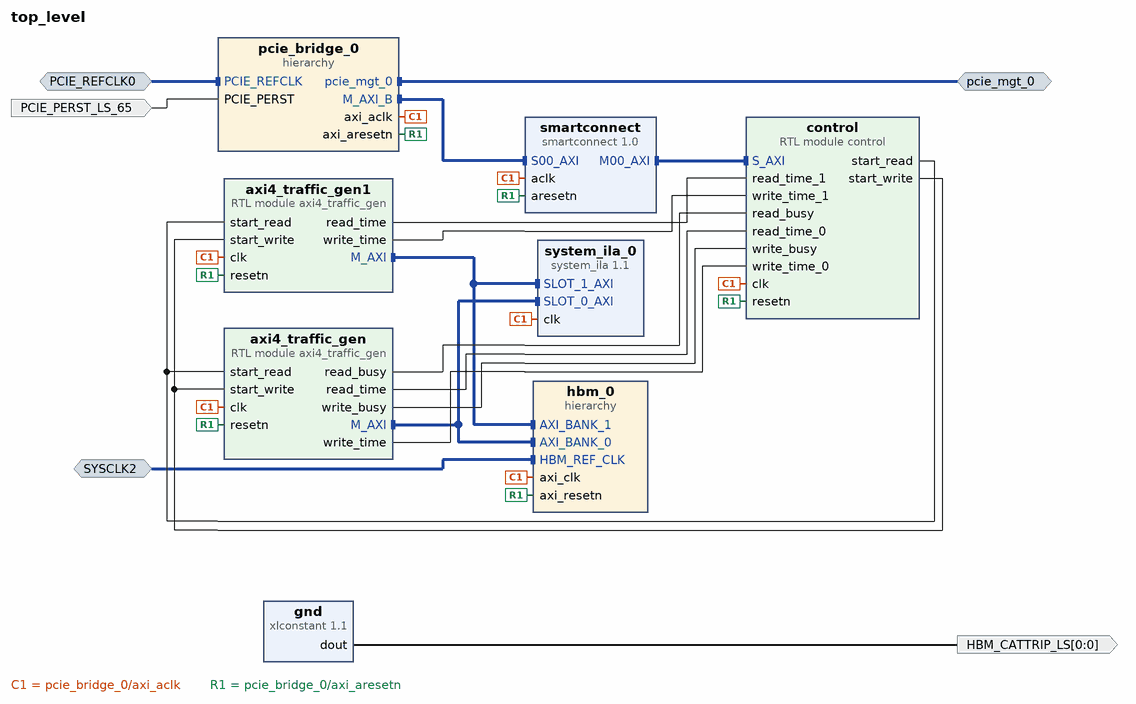
[diagram p0: block diagram of the top level]
# Vivado block design top_level, xcu55c-fsvh2892-2L-e, Vivado 2021.1
create_bd_design top_level

create_bd_intf_port -mode Slave -vlnv xilinx.com:interface:diff_clock_rtl:1.0 SYSCLK2
create_bd_intf_port -mode Slave -vlnv xilinx.com:interface:diff_clock_rtl:1.0 PCIE_REFCLK0
create_bd_intf_port -mode Master -vlnv xilinx.com:interface:pcie_7x_mgt_rtl:1.0 pcie_mgt_0
create_bd_port -dir O -from 0 -to 0 HBM_CATTRIP_LS
create_bd_port -dir I -type rst PCIE_PERST_LS_65

create_bd_cell -type hier pcie_bridge_0
create_bd_cell -type ip -vlnv xilinx.com:ip:smartconnect:1.0 smartconnect
set_property -dict {CONFIG.NUM_SI 1} [get_bd_cells smartconnect]
create_bd_cell -type ip -vlnv xilinx.com:ip:xlconstant:1.1 gnd
set_property -dict {CONFIG.CONST_VAL 0} [get_bd_cells gnd]
create_bd_cell -type hier hbm_0
create_bd_cell -type module -reference axi4_traffic_gen axi4_traffic_gen
create_bd_cell -type module -reference axi4_traffic_gen axi4_traffic_gen1
create_bd_cell -type module -reference control control
create_bd_cell -type ip -vlnv xilinx.com:ip:system_ila:1.1 system_ila_0
set_property -dict {CONFIG.C_DATA_DEPTH 2048 CONFIG.C_NUM_MONITOR_SLOTS 2} [get_bd_cells system_ila_0]

# ---- hierarchy /pcie_bridge_0 ----
current_bd_instance /pcie_bridge_0
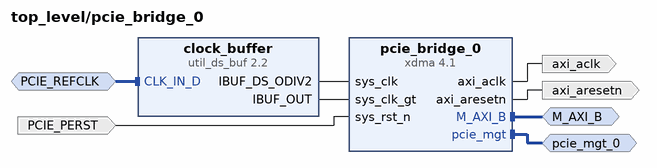
[diagram p1: block diagram inside /pcie_bridge_0]
create_bd_intf_pin -mode Master -vlnv xilinx.com:interface:pcie_7x_mgt_rtl:1.0 pcie_mgt_0
create_bd_intf_pin -mode Slave -vlnv xilinx.com:interface:diff_clock_rtl:1.0 PCIE_REFCLK
create_bd_intf_pin -mode Master -vlnv xilinx.com:interface:aximm_rtl:1.0 M_AXI_B
create_bd_pin -dir I -type rst PCIE_PERST
create_bd_pin -dir O axi_aclk
create_bd_pin -dir O axi_aresetn

create_bd_cell -type ip -vlnv xilinx.com:ip:xdma:4.1 pcie_bridge_0
set_property -dict [list \
  CONFIG.PF0_DEVICE_ID_mqdma 9048 \
  CONFIG.PF0_SRIOV_VF_DEVICE_ID A048 \
  CONFIG.PF2_DEVICE_ID_mqdma 9248 \
  CONFIG.PF3_DEVICE_ID_mqdma 9348 \
  CONFIG.axi_addr_width 64 \
  CONFIG.axi_data_width 512_bit \
  CONFIG.axisten_freq 250 \
  CONFIG.bridge_burst true \
  CONFIG.en_axi_slave_if false \
  CONFIG.en_gt_selection false \
  CONFIG.functional_mode AXI_Bridge \
  CONFIG.mode_selection Advanced \
  CONFIG.pcie_blk_locn PCIE4C_X1Y0 \
  CONFIG.pf0_bar0_scale Megabytes \
  CONFIG.pf0_bar0_size 1 \
  CONFIG.pf0_device_id 903F \
  CONFIG.pf0_msi_enabled false \
  CONFIG.pl_link_cap_max_link_speed 16.0_GT/s \
  CONFIG.pl_link_cap_max_link_width X8 \
] [get_bd_cells pcie_bridge_0]
create_bd_cell -type ip -vlnv xilinx.com:ip:util_ds_buf:2.2 clock_buffer
set_property -dict {CONFIG.C_BUF_TYPE IBUFDSGTE} [get_bd_cells clock_buffer]

# ---- hierarchy /hbm_0 ----
current_bd_instance /hbm_0
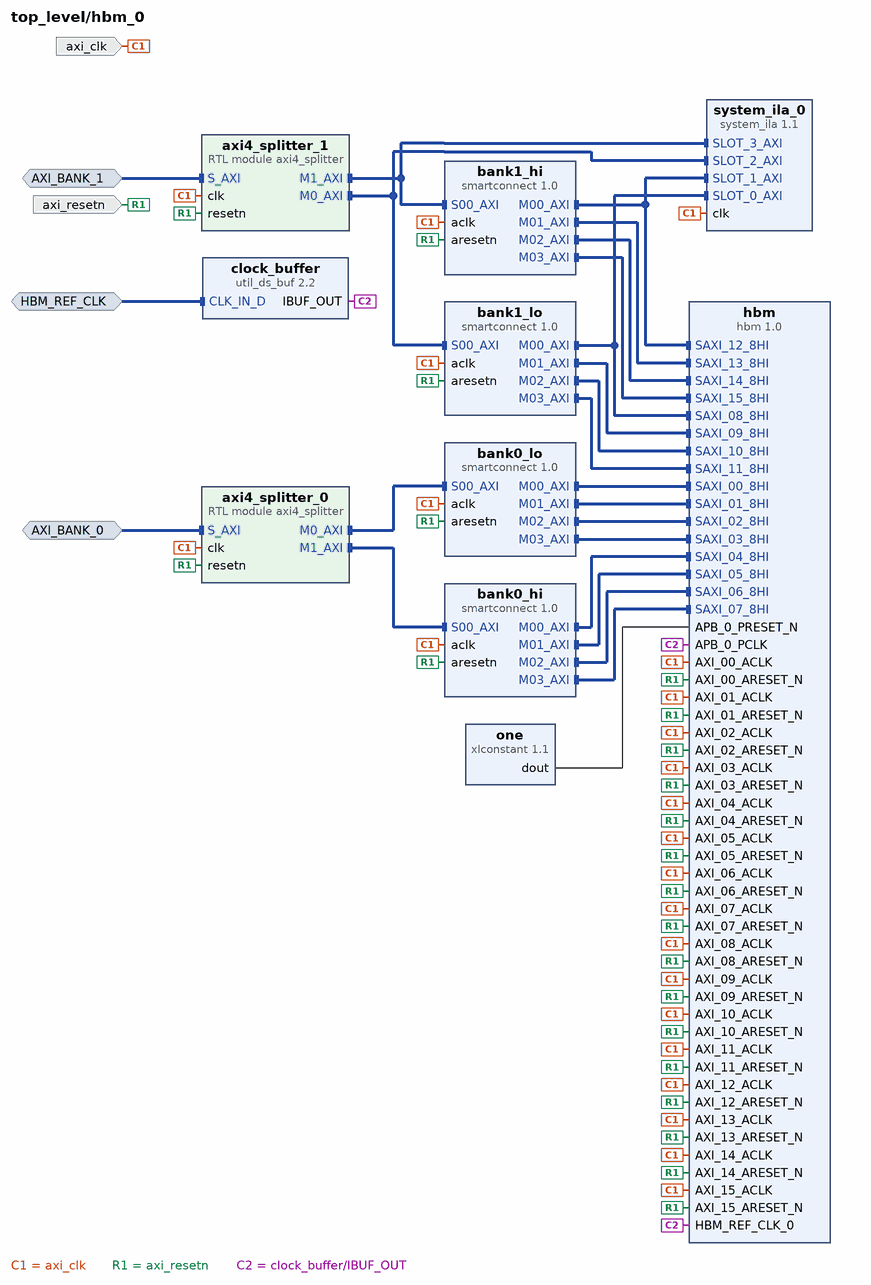
[diagram p2: block diagram inside /hbm_0]
create_bd_intf_pin -mode Slave -vlnv xilinx.com:interface:diff_clock_rtl:1.0 HBM_REF_CLK
create_bd_intf_pin -mode Slave -vlnv xilinx.com:interface:aximm_rtl:1.0 AXI_BANK_0
create_bd_intf_pin -mode Slave -vlnv xilinx.com:interface:aximm_rtl:1.0 AXI_BANK_1
create_bd_pin -dir I axi_clk
create_bd_pin -dir I axi_resetn

create_bd_cell -type ip -vlnv xilinx.com:ip:hbm:1.0 hbm
set_property -dict [list \
  CONFIG.USER_APB_EN false \
  CONFIG.USER_AXI_CLK_FREQ 250 \
  CONFIG.USER_CLK_SEL_LIST1 AXI_23_ACLK \
  CONFIG.USER_HBM_CP_1 3 \
  CONFIG.USER_HBM_DENSITY 8GB \
  CONFIG.USER_HBM_FBDIV_1 5 \
  CONFIG.USER_HBM_HEX_CP_RES_1 0x0000B300 \
  CONFIG.USER_HBM_HEX_FBDIV_CLKOUTDIV_1 0x00000142 \
  CONFIG.USER_HBM_HEX_LOCK_FB_REF_DLY_1 0x00000a0a \
  CONFIG.USER_HBM_LOCK_FB_DLY_1 10 \
  CONFIG.USER_HBM_LOCK_REF_DLY_1 10 \
  CONFIG.USER_HBM_RES_1 11 \
  CONFIG.USER_HBM_STACK 1 \
  CONFIG.USER_MC0_ENABLE_ECC_CORRECTION true \
  CONFIG.USER_MC0_ENABLE_ECC_SCRUBBING false \
  CONFIG.USER_MC0_INITILIZE_MEM_USING_ECC_SCRUB false \
  CONFIG.USER_MC0_TRAFFIC_OPTION Linear \
  CONFIG.USER_MC10_ENABLE_ECC_CORRECTION true \
  CONFIG.USER_MC10_ENABLE_ECC_SCRUBBING false \
  CONFIG.USER_MC10_INITILIZE_MEM_USING_ECC_SCRUB false \
  CONFIG.USER_MC10_TRAFFIC_OPTION Linear \
  CONFIG.USER_MC11_ENABLE_ECC_CORRECTION true \
  CONFIG.USER_MC11_ENABLE_ECC_SCRUBBING false \
  CONFIG.USER_MC11_INITILIZE_MEM_USING_ECC_SCRUB false \
  CONFIG.USER_MC11_TRAFFIC_OPTION Linear \
  CONFIG.USER_MC12_ENABLE_ECC_CORRECTION true \
  CONFIG.USER_MC12_ENABLE_ECC_SCRUBBING false \
  CONFIG.USER_MC12_INITILIZE_MEM_USING_ECC_SCRUB false \
  CONFIG.USER_MC12_TRAFFIC_OPTION Linear \
  CONFIG.USER_MC13_ENABLE_ECC_CORRECTION true \
  CONFIG.USER_MC13_ENABLE_ECC_SCRUBBING false \
  CONFIG.USER_MC13_INITILIZE_MEM_USING_ECC_SCRUB false \
  CONFIG.USER_MC13_TRAFFIC_OPTION Linear \
  CONFIG.USER_MC14_ENABLE_ECC_CORRECTION true \
  CONFIG.USER_MC14_ENABLE_ECC_SCRUBBING false \
  CONFIG.USER_MC14_INITILIZE_MEM_USING_ECC_SCRUB false \
  CONFIG.USER_MC14_TRAFFIC_OPTION Linear \
  CONFIG.USER_MC15_ENABLE_ECC_CORRECTION true \
  CONFIG.USER_MC15_ENABLE_ECC_SCRUBBING false \
  CONFIG.USER_MC15_INITILIZE_MEM_USING_ECC_SCRUB false \
  CONFIG.USER_MC15_TRAFFIC_OPTION Linear \
  CONFIG.USER_MC1_ENABLE_ECC_CORRECTION true \
  CONFIG.USER_MC1_ENABLE_ECC_SCRUBBING false \
  CONFIG.USER_MC1_INITILIZE_MEM_USING_ECC_SCRUB false \
  CONFIG.USER_MC1_TRAFFIC_OPTION Linear \
  CONFIG.USER_MC2_ENABLE_ECC_CORRECTION true \
  CONFIG.USER_MC2_ENABLE_ECC_SCRUBBING false \
  CONFIG.USER_MC2_INITILIZE_MEM_USING_ECC_SCRUB false \
  CONFIG.USER_MC2_TRAFFIC_OPTION Linear \
  CONFIG.USER_MC3_ENABLE_ECC_CORRECTION true \
  CONFIG.USER_MC3_ENABLE_ECC_SCRUBBING false \
  CONFIG.USER_MC3_INITILIZE_MEM_USING_ECC_SCRUB false \
  CONFIG.USER_MC3_TRAFFIC_OPTION Linear \
  CONFIG.USER_MC4_ENABLE_ECC_CORRECTION true \
  CONFIG.USER_MC4_ENABLE_ECC_SCRUBBING false \
  CONFIG.USER_MC4_INITILIZE_MEM_USING_ECC_SCRUB false \
  CONFIG.USER_MC4_TRAFFIC_OPTION Linear \
  CONFIG.USER_MC5_ENABLE_ECC_CORRECTION true \
  CONFIG.USER_MC5_ENABLE_ECC_SCRUBBING false \
  CONFIG.USER_MC5_INITILIZE_MEM_USING_ECC_SCRUB false \
  CONFIG.USER_MC5_TRAFFIC_OPTION Linear \
  CONFIG.USER_MC6_ENABLE_ECC_CORRECTION true \
  CONFIG.USER_MC6_ENABLE_ECC_SCRUBBING false \
  CONFIG.USER_MC6_INITILIZE_MEM_USING_ECC_SCRUB false \
  CONFIG.USER_MC6_TRAFFIC_OPTION Linear \
  CONFIG.USER_MC7_ENABLE_ECC_CORRECTION true \
  CONFIG.USER_MC7_ENABLE_ECC_SCRUBBING false \
  CONFIG.USER_MC7_INITILIZE_MEM_USING_ECC_SCRUB false \
  CONFIG.USER_MC7_TRAFFIC_OPTION Linear \
  CONFIG.USER_MC8_ENABLE_ECC_CORRECTION true \
  CONFIG.USER_MC8_ENABLE_ECC_SCRUBBING false \
  CONFIG.USER_MC8_INITILIZE_MEM_USING_ECC_SCRUB false \
  CONFIG.USER_MC8_TRAFFIC_OPTION Linear \
  CONFIG.USER_MC9_ENABLE_ECC_CORRECTION true \
  CONFIG.USER_MC9_ENABLE_ECC_SCRUBBING false \
  CONFIG.USER_MC9_INITILIZE_MEM_USING_ECC_SCRUB false \
  CONFIG.USER_MC9_TRAFFIC_OPTION Linear \
  CONFIG.USER_MC_ENABLE_08 FALSE \
  CONFIG.USER_MC_ENABLE_09 FALSE \
  CONFIG.USER_MC_ENABLE_10 FALSE \
  CONFIG.USER_MC_ENABLE_11 FALSE \
  CONFIG.USER_MC_ENABLE_12 FALSE \
  CONFIG.USER_MC_ENABLE_13 FALSE \
  CONFIG.USER_MC_ENABLE_14 FALSE \
  CONFIG.USER_MC_ENABLE_15 FALSE \
  CONFIG.USER_MC_ENABLE_APB_01 FALSE \
  CONFIG.USER_PHY_ENABLE_08 FALSE \
  CONFIG.USER_PHY_ENABLE_09 FALSE \
  CONFIG.USER_PHY_ENABLE_10 FALSE \
  CONFIG.USER_PHY_ENABLE_11 FALSE \
  CONFIG.USER_PHY_ENABLE_12 FALSE \
  CONFIG.USER_PHY_ENABLE_13 FALSE \
  CONFIG.USER_PHY_ENABLE_14 FALSE \
  CONFIG.USER_PHY_ENABLE_15 FALSE \
  CONFIG.USER_SWITCH_ENABLE_00 FALSE \
] [get_bd_cells hbm]
create_bd_cell -type ip -vlnv xilinx.com:ip:util_ds_buf:2.2 clock_buffer
create_bd_cell -type ip -vlnv xilinx.com:ip:smartconnect:1.0 bank0_lo
set_property -dict {CONFIG.HAS_ARESETN 1 CONFIG.NUM_MI 4 CONFIG.NUM_SI 1} [get_bd_cells bank0_lo]
create_bd_cell -type ip -vlnv xilinx.com:ip:xlconstant:1.1 one
create_bd_cell -type ip -vlnv xilinx.com:ip:smartconnect:1.0 bank0_hi
set_property -dict {CONFIG.HAS_ARESETN 1 CONFIG.NUM_MI 4 CONFIG.NUM_SI 1} [get_bd_cells bank0_hi]
create_bd_cell -type ip -vlnv xilinx.com:ip:smartconnect:1.0 bank1_lo
set_property -dict {CONFIG.HAS_ARESETN 1 CONFIG.NUM_MI 4 CONFIG.NUM_SI 1} [get_bd_cells bank1_lo]
create_bd_cell -type ip -vlnv xilinx.com:ip:smartconnect:1.0 bank1_hi
set_property -dict {CONFIG.HAS_ARESETN 1 CONFIG.NUM_MI 4 CONFIG.NUM_SI 1} [get_bd_cells bank1_hi]
create_bd_cell -type ip -vlnv xilinx.com:ip:system_ila:1.1 system_ila_0
set_property -dict {CONFIG.C_NUM_MONITOR_SLOTS 4} [get_bd_cells system_ila_0]
create_bd_cell -type module -reference axi4_splitter axi4_splitter_0
set_property -dict {CONFIG.BASE_ADDR1 0x0000000080000000} [get_bd_cells axi4_splitter_0]
create_bd_cell -type module -reference axi4_splitter axi4_splitter_1
set_property -dict {CONFIG.BASE_ADDR0 0x0000000100000000 CONFIG.BASE_ADDR1 0x0000000180000000} [get_bd_cells axi4_splitter_1]

# ---- connections ----

current_bd_instance /pcie_bridge_0
connect_bd_intf_net -intf_net CLK_IN_D_0_1 [get_bd_intf_pins PCIE_REFCLK] [get_bd_intf_pins clock_buffer/CLK_IN_D]
connect_bd_intf_net -intf_net xdma_0_M_AXI_B [get_bd_intf_pins M_AXI_B] [get_bd_intf_pins pcie_bridge_0/M_AXI_B]
connect_bd_intf_net -intf_net xdma_0_pcie_mgt [get_bd_intf_pins pcie_mgt_0] [get_bd_intf_pins pcie_bridge_0/pcie_mgt]
connect_bd_net -net sys_rst_n_0_1 [get_bd_pins PCIE_PERST] [get_bd_pins pcie_bridge_0/sys_rst_n]
connect_bd_net -net util_ds_buf_0_IBUF_DS_ODIV2 [get_bd_pins clock_buffer/IBUF_DS_ODIV2] [get_bd_pins pcie_bridge_0/sys_clk]
connect_bd_net -net util_ds_buf_0_IBUF_OUT [get_bd_pins clock_buffer/IBUF_OUT] [get_bd_pins pcie_bridge_0/sys_clk_gt]
connect_bd_net -net xdma_0_axi_aclk [get_bd_pins pcie_bridge_0/axi_aclk] [get_bd_pins axi_aclk]
connect_bd_net -net xdma_0_axi_aresetn [get_bd_pins pcie_bridge_0/axi_aresetn] [get_bd_pins axi_aresetn]

current_bd_instance /hbm_0
connect_bd_intf_net -intf_net AXI_BANK_0_1 [get_bd_intf_pins AXI_BANK_0] [get_bd_intf_pins axi4_splitter_0/S_AXI]
connect_bd_intf_net -intf_net AXI_BANK_1_1 [get_bd_intf_pins AXI_BANK_1] [get_bd_intf_pins axi4_splitter_1/S_AXI]
connect_bd_intf_net [get_bd_intf_pins HBM_REF_CLK] [get_bd_intf_pins clock_buffer/CLK_IN_D]
connect_bd_intf_net [get_bd_intf_pins axi4_splitter_0/M0_AXI] [get_bd_intf_pins bank0_lo/S00_AXI]
connect_bd_intf_net [get_bd_intf_pins axi4_splitter_0/M1_AXI] [get_bd_intf_pins bank0_hi/S00_AXI]
connect_bd_intf_net [get_bd_intf_pins axi4_splitter_1/M0_AXI] [get_bd_intf_pins bank1_lo/S00_AXI]
connect_bd_intf_net [get_bd_intf_pins axi4_splitter_1/M0_AXI] [get_bd_intf_pins system_ila_0/SLOT_2_AXI]
connect_bd_intf_net [get_bd_intf_pins axi4_splitter_1/M1_AXI] [get_bd_intf_pins bank1_hi/S00_AXI]
connect_bd_intf_net [get_bd_intf_pins axi4_splitter_1/M1_AXI] [get_bd_intf_pins system_ila_0/SLOT_3_AXI]
connect_bd_intf_net [get_bd_intf_pins bank1_hi/M00_AXI] [get_bd_intf_pins hbm/SAXI_12_8HI]
connect_bd_intf_net [get_bd_intf_pins bank1_hi/M00_AXI] [get_bd_intf_pins system_ila_0/SLOT_1_AXI]
connect_bd_intf_net [get_bd_intf_pins bank1_hi/M01_AXI] [get_bd_intf_pins hbm/SAXI_13_8HI]
connect_bd_intf_net [get_bd_intf_pins bank1_hi/M02_AXI] [get_bd_intf_pins hbm/SAXI_14_8HI]
connect_bd_intf_net [get_bd_intf_pins bank1_hi/M03_AXI] [get_bd_intf_pins hbm/SAXI_15_8HI]
connect_bd_intf_net [get_bd_intf_pins bank1_lo/M00_AXI] [get_bd_intf_pins hbm/SAXI_08_8HI]
connect_bd_intf_net [get_bd_intf_pins bank1_lo/M00_AXI] [get_bd_intf_pins system_ila_0/SLOT_0_AXI]
connect_bd_intf_net [get_bd_intf_pins bank1_lo/M01_AXI] [get_bd_intf_pins hbm/SAXI_09_8HI]
connect_bd_intf_net [get_bd_intf_pins bank1_lo/M02_AXI] [get_bd_intf_pins hbm/SAXI_10_8HI]
connect_bd_intf_net [get_bd_intf_pins bank1_lo/M03_AXI] [get_bd_intf_pins hbm/SAXI_11_8HI]
connect_bd_intf_net -intf_net smartconnect_0_M00_AXI [get_bd_intf_pins bank0_lo/M00_AXI] [get_bd_intf_pins hbm/SAXI_00_8HI]
connect_bd_intf_net -intf_net smartconnect_0_M01_AXI [get_bd_intf_pins bank0_lo/M01_AXI] [get_bd_intf_pins hbm/SAXI_01_8HI]
connect_bd_intf_net -intf_net smartconnect_0_M02_AXI [get_bd_intf_pins bank0_lo/M02_AXI] [get_bd_intf_pins hbm/SAXI_02_8HI]
connect_bd_intf_net -intf_net smartconnect_0_M03_AXI [get_bd_intf_pins bank0_lo/M03_AXI] [get_bd_intf_pins hbm/SAXI_03_8HI]
connect_bd_intf_net -intf_net smartconnect_2_M00_AXI [get_bd_intf_pins bank0_hi/M00_AXI] [get_bd_intf_pins hbm/SAXI_04_8HI]
connect_bd_intf_net -intf_net smartconnect_2_M01_AXI [get_bd_intf_pins bank0_hi/M01_AXI] [get_bd_intf_pins hbm/SAXI_05_8HI]
connect_bd_intf_net -intf_net smartconnect_2_M02_AXI [get_bd_intf_pins bank0_hi/M02_AXI] [get_bd_intf_pins hbm/SAXI_06_8HI]
connect_bd_intf_net -intf_net smartconnect_2_M03_AXI [get_bd_intf_pins bank0_hi/M03_AXI] [get_bd_intf_pins hbm/SAXI_07_8HI]
connect_bd_net -net AXI_00_ACLK_1 [get_bd_pins axi_clk] \
  [get_bd_pins hbm/AXI_00_ACLK] [get_bd_pins hbm/AXI_02_ACLK] [get_bd_pins hbm/AXI_04_ACLK] [get_bd_pins hbm/AXI_03_ACLK] \
  [get_bd_pins hbm/AXI_07_ACLK] [get_bd_pins hbm/AXI_06_ACLK] [get_bd_pins hbm/AXI_08_ACLK] [get_bd_pins hbm/AXI_05_ACLK] \
  [get_bd_pins hbm/AXI_11_ACLK] [get_bd_pins hbm/AXI_09_ACLK] [get_bd_pins hbm/AXI_10_ACLK] [get_bd_pins hbm/AXI_12_ACLK] \
  [get_bd_pins hbm/AXI_15_ACLK] [get_bd_pins hbm/AXI_13_ACLK] [get_bd_pins hbm/AXI_14_ACLK] [get_bd_pins hbm/AXI_01_ACLK] \
  [get_bd_pins bank0_lo/aclk] [get_bd_pins bank0_hi/aclk] [get_bd_pins bank1_lo/aclk] [get_bd_pins bank1_hi/aclk] \
  [get_bd_pins system_ila_0/clk] [get_bd_pins axi4_splitter_0/clk] [get_bd_pins axi4_splitter_1/clk]
connect_bd_net -net AXI_00_ARESET_N_1 [get_bd_pins axi_resetn] \
  [get_bd_pins hbm/AXI_00_ARESET_N] [get_bd_pins hbm/AXI_09_ARESET_N] [get_bd_pins hbm/AXI_05_ARESET_N] \
  [get_bd_pins hbm/AXI_04_ARESET_N] [get_bd_pins hbm/AXI_01_ARESET_N] [get_bd_pins hbm/AXI_06_ARESET_N] \
  [get_bd_pins hbm/AXI_02_ARESET_N] [get_bd_pins hbm/AXI_03_ARESET_N] [get_bd_pins hbm/AXI_10_ARESET_N] \
  [get_bd_pins hbm/AXI_07_ARESET_N] [get_bd_pins hbm/AXI_14_ARESET_N] [get_bd_pins hbm/AXI_11_ARESET_N] \
  [get_bd_pins hbm/AXI_08_ARESET_N] [get_bd_pins hbm/AXI_12_ARESET_N] [get_bd_pins hbm/AXI_13_ARESET_N] \
  [get_bd_pins hbm/AXI_15_ARESET_N] [get_bd_pins bank0_lo/aresetn] [get_bd_pins bank0_hi/aresetn] \
  [get_bd_pins bank1_lo/aresetn] [get_bd_pins bank1_hi/aresetn] [get_bd_pins axi4_splitter_0/resetn] \
  [get_bd_pins axi4_splitter_1/resetn]
connect_bd_net [get_bd_pins clock_buffer/IBUF_OUT] [get_bd_pins hbm/HBM_REF_CLK_0] [get_bd_pins hbm/APB_0_PCLK]
connect_bd_net [get_bd_pins one/dout] [get_bd_pins hbm/APB_0_PRESET_N]

current_bd_instance /
connect_bd_intf_net -intf_net CLK_IN_D_0_1 [get_bd_intf_ports PCIE_REFCLK0] [get_bd_intf_pins pcie_bridge_0/PCIE_REFCLK]
connect_bd_intf_net -intf_net SYSCLK2_1 [get_bd_intf_ports SYSCLK2] [get_bd_intf_pins hbm_0/HBM_REF_CLK]
connect_bd_intf_net [get_bd_intf_pins axi4_traffic_gen1/M_AXI] [get_bd_intf_pins hbm_0/AXI_BANK_1]
connect_bd_intf_net [get_bd_intf_pins axi4_traffic_gen1/M_AXI] [get_bd_intf_pins system_ila_0/SLOT_1_AXI]
connect_bd_intf_net -intf_net axi4_traffic_gen_0_M_AXI [get_bd_intf_pins axi4_traffic_gen/M_AXI] [get_bd_intf_pins hbm_0/AXI_BANK_0]
connect_bd_intf_net [get_bd_intf_pins axi4_traffic_gen/M_AXI] [get_bd_intf_pins system_ila_0/SLOT_0_AXI]
connect_bd_intf_net [get_bd_intf_pins pcie_bridge_0/M_AXI_B] [get_bd_intf_pins smartconnect/S00_AXI]
connect_bd_intf_net [get_bd_intf_pins control/S_AXI] [get_bd_intf_pins smartconnect/M00_AXI]
connect_bd_intf_net -intf_net xdma_0_pcie_mgt [get_bd_intf_ports pcie_mgt_0] [get_bd_intf_pins pcie_bridge_0/pcie_mgt_0]
connect_bd_net [get_bd_pins axi4_traffic_gen1/read_time] [get_bd_pins control/read_time_1]
connect_bd_net [get_bd_pins axi4_traffic_gen1/write_time] [get_bd_pins control/write_time_1]
connect_bd_net [get_bd_pins axi4_traffic_gen/read_busy] [get_bd_pins control/read_busy]
connect_bd_net [get_bd_pins axi4_traffic_gen/read_time] [get_bd_pins control/read_time_0]
connect_bd_net [get_bd_pins axi4_traffic_gen/write_busy] [get_bd_pins control/write_busy]
connect_bd_net [get_bd_pins axi4_traffic_gen/write_time] [get_bd_pins control/write_time_0]
connect_bd_net [get_bd_pins control/start_read] [get_bd_pins axi4_traffic_gen/start_read] [get_bd_pins axi4_traffic_gen1/start_read]
connect_bd_net [get_bd_pins control/start_write] [get_bd_pins axi4_traffic_gen/start_write] [get_bd_pins axi4_traffic_gen1/start_write]
connect_bd_net [get_bd_pins gnd/dout] [get_bd_ports HBM_CATTRIP_LS]
connect_bd_net [get_bd_pins pcie_bridge_0/axi_aclk] \
  [get_bd_pins smartconnect/aclk] [get_bd_pins hbm_0/axi_clk] [get_bd_pins axi4_traffic_gen/clk] \
  [get_bd_pins axi4_traffic_gen1/clk] [get_bd_pins control/clk] [get_bd_pins system_ila_0/clk]
connect_bd_net [get_bd_pins pcie_bridge_0/axi_aresetn] \
  [get_bd_pins smartconnect/aresetn] [get_bd_pins hbm_0/axi_resetn] [get_bd_pins axi4_traffic_gen/resetn] \
  [get_bd_pins axi4_traffic_gen1/resetn] [get_bd_pins control/resetn]
connect_bd_net -net sys_rst_n_0_1 [get_bd_ports PCIE_PERST_LS_65] [get_bd_pins pcie_bridge_0/PCIE_PERST]

# ---- address map ----
assign_bd_address -offset 0x0000000000000000 -range 16E -target_address_space [get_bd_addr_spaces axi4_traffic_gen1/M_AXI] [get_bd_addr_segs hbm_0/axi4_splitter_1/S_AXI/reg0]
assign_bd_address -offset 0x0000000000000000 -range 16E -target_address_space [get_bd_addr_spaces axi4_traffic_gen/M_AXI] [get_bd_addr_segs hbm_0/axi4_splitter_0/S_AXI/reg0]
assign_bd_address -offset 0x000000000 -range 512M -target_address_space [get_bd_addr_spaces hbm_0/axi4_splitter_0/M0_AXI] [get_bd_addr_segs hbm_0/hbm/SAXI_00_8HI/HBM_MEM00]
assign_bd_address -offset 0x020000000 -range 512M -target_address_space [get_bd_addr_spaces hbm_0/axi4_splitter_0/M0_AXI] [get_bd_addr_segs hbm_0/hbm/SAXI_01_8HI/HBM_MEM01]
assign_bd_address -offset 0x040000000 -range 512M -target_address_space [get_bd_addr_spaces hbm_0/axi4_splitter_0/M0_AXI] [get_bd_addr_segs hbm_0/hbm/SAXI_02_8HI/HBM_MEM02]
assign_bd_address -offset 0x060000000 -range 512M -target_address_space [get_bd_addr_spaces hbm_0/axi4_splitter_0/M0_AXI] [get_bd_addr_segs hbm_0/hbm/SAXI_03_8HI/HBM_MEM03]
assign_bd_address -offset 0x080000000 -range 512M -target_address_space [get_bd_addr_spaces hbm_0/axi4_splitter_0/M1_AXI] [get_bd_addr_segs hbm_0/hbm/SAXI_04_8HI/HBM_MEM04]
assign_bd_address -offset 0x0A0000000 -range 512M -target_address_space [get_bd_addr_spaces hbm_0/axi4_splitter_0/M1_AXI] [get_bd_addr_segs hbm_0/hbm/SAXI_05_8HI/HBM_MEM05]
assign_bd_address -offset 0x0C0000000 -range 512M -target_address_space [get_bd_addr_spaces hbm_0/axi4_splitter_0/M1_AXI] [get_bd_addr_segs hbm_0/hbm/SAXI_06_8HI/HBM_MEM06]
assign_bd_address -offset 0x0E0000000 -range 512M -target_address_space [get_bd_addr_spaces hbm_0/axi4_splitter_0/M1_AXI] [get_bd_addr_segs hbm_0/hbm/SAXI_07_8HI/HBM_MEM07]
assign_bd_address -offset 0x100000000 -range 512M -target_address_space [get_bd_addr_spaces hbm_0/axi4_splitter_1/M0_AXI] [get_bd_addr_segs hbm_0/hbm/SAXI_08_8HI/HBM_MEM08]
assign_bd_address -offset 0x120000000 -range 512M -target_address_space [get_bd_addr_spaces hbm_0/axi4_splitter_1/M0_AXI] [get_bd_addr_segs hbm_0/hbm/SAXI_09_8HI/HBM_MEM09]
assign_bd_address -offset 0x140000000 -range 512M -target_address_space [get_bd_addr_spaces hbm_0/axi4_splitter_1/M0_AXI] [get_bd_addr_segs hbm_0/hbm/SAXI_10_8HI/HBM_MEM10]
assign_bd_address -offset 0x160000000 -range 512M -target_address_space [get_bd_addr_spaces hbm_0/axi4_splitter_1/M0_AXI] [get_bd_addr_segs hbm_0/hbm/SAXI_11_8HI/HBM_MEM11]
assign_bd_address -offset 0x180000000 -range 512M -target_address_space [get_bd_addr_spaces hbm_0/axi4_splitter_1/M1_AXI] [get_bd_addr_segs hbm_0/hbm/SAXI_12_8HI/HBM_MEM12]
assign_bd_address -offset 0x1A0000000 -range 512M -target_address_space [get_bd_addr_spaces hbm_0/axi4_splitter_1/M1_AXI] [get_bd_addr_segs hbm_0/hbm/SAXI_13_8HI/HBM_MEM13]
assign_bd_address -offset 0x1C0000000 -range 512M -target_address_space [get_bd_addr_spaces hbm_0/axi4_splitter_1/M1_AXI] [get_bd_addr_segs hbm_0/hbm/SAXI_14_8HI/HBM_MEM14]
assign_bd_address -offset 0x1E0000000 -range 512M -target_address_space [get_bd_addr_spaces hbm_0/axi4_splitter_1/M1_AXI] [get_bd_addr_segs hbm_0/hbm/SAXI_15_8HI/HBM_MEM15]
assign_bd_address -offset 0x0000000000001000 -range 256 -target_address_space [get_bd_addr_spaces pcie_bridge_0/pcie_bridge_0/M_AXI_B] [get_bd_addr_segs control/S_AXI/reg0]

validate_bd_design
save_bd_design
